# EAGLE schematic TellitShieldV45JR (EAGLE 5.11)
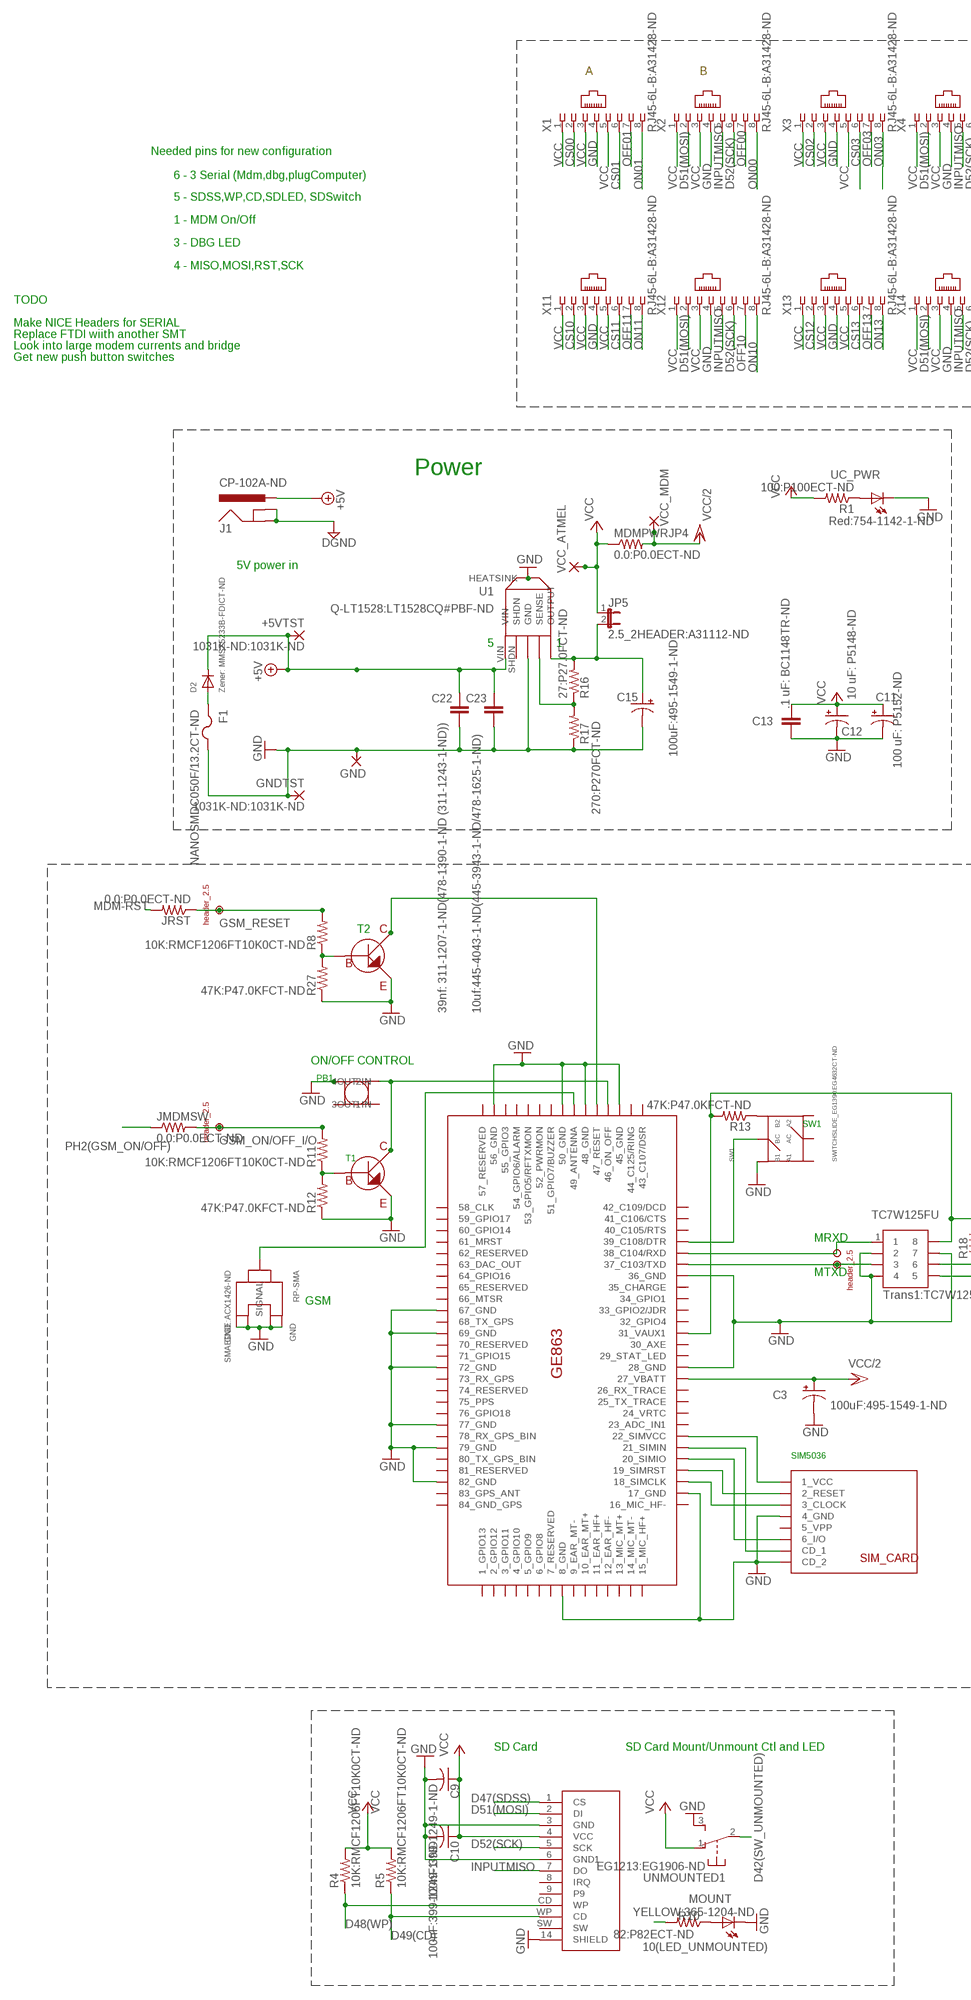
[diagram p0: schematic, sheet 1, part 1 of 2]
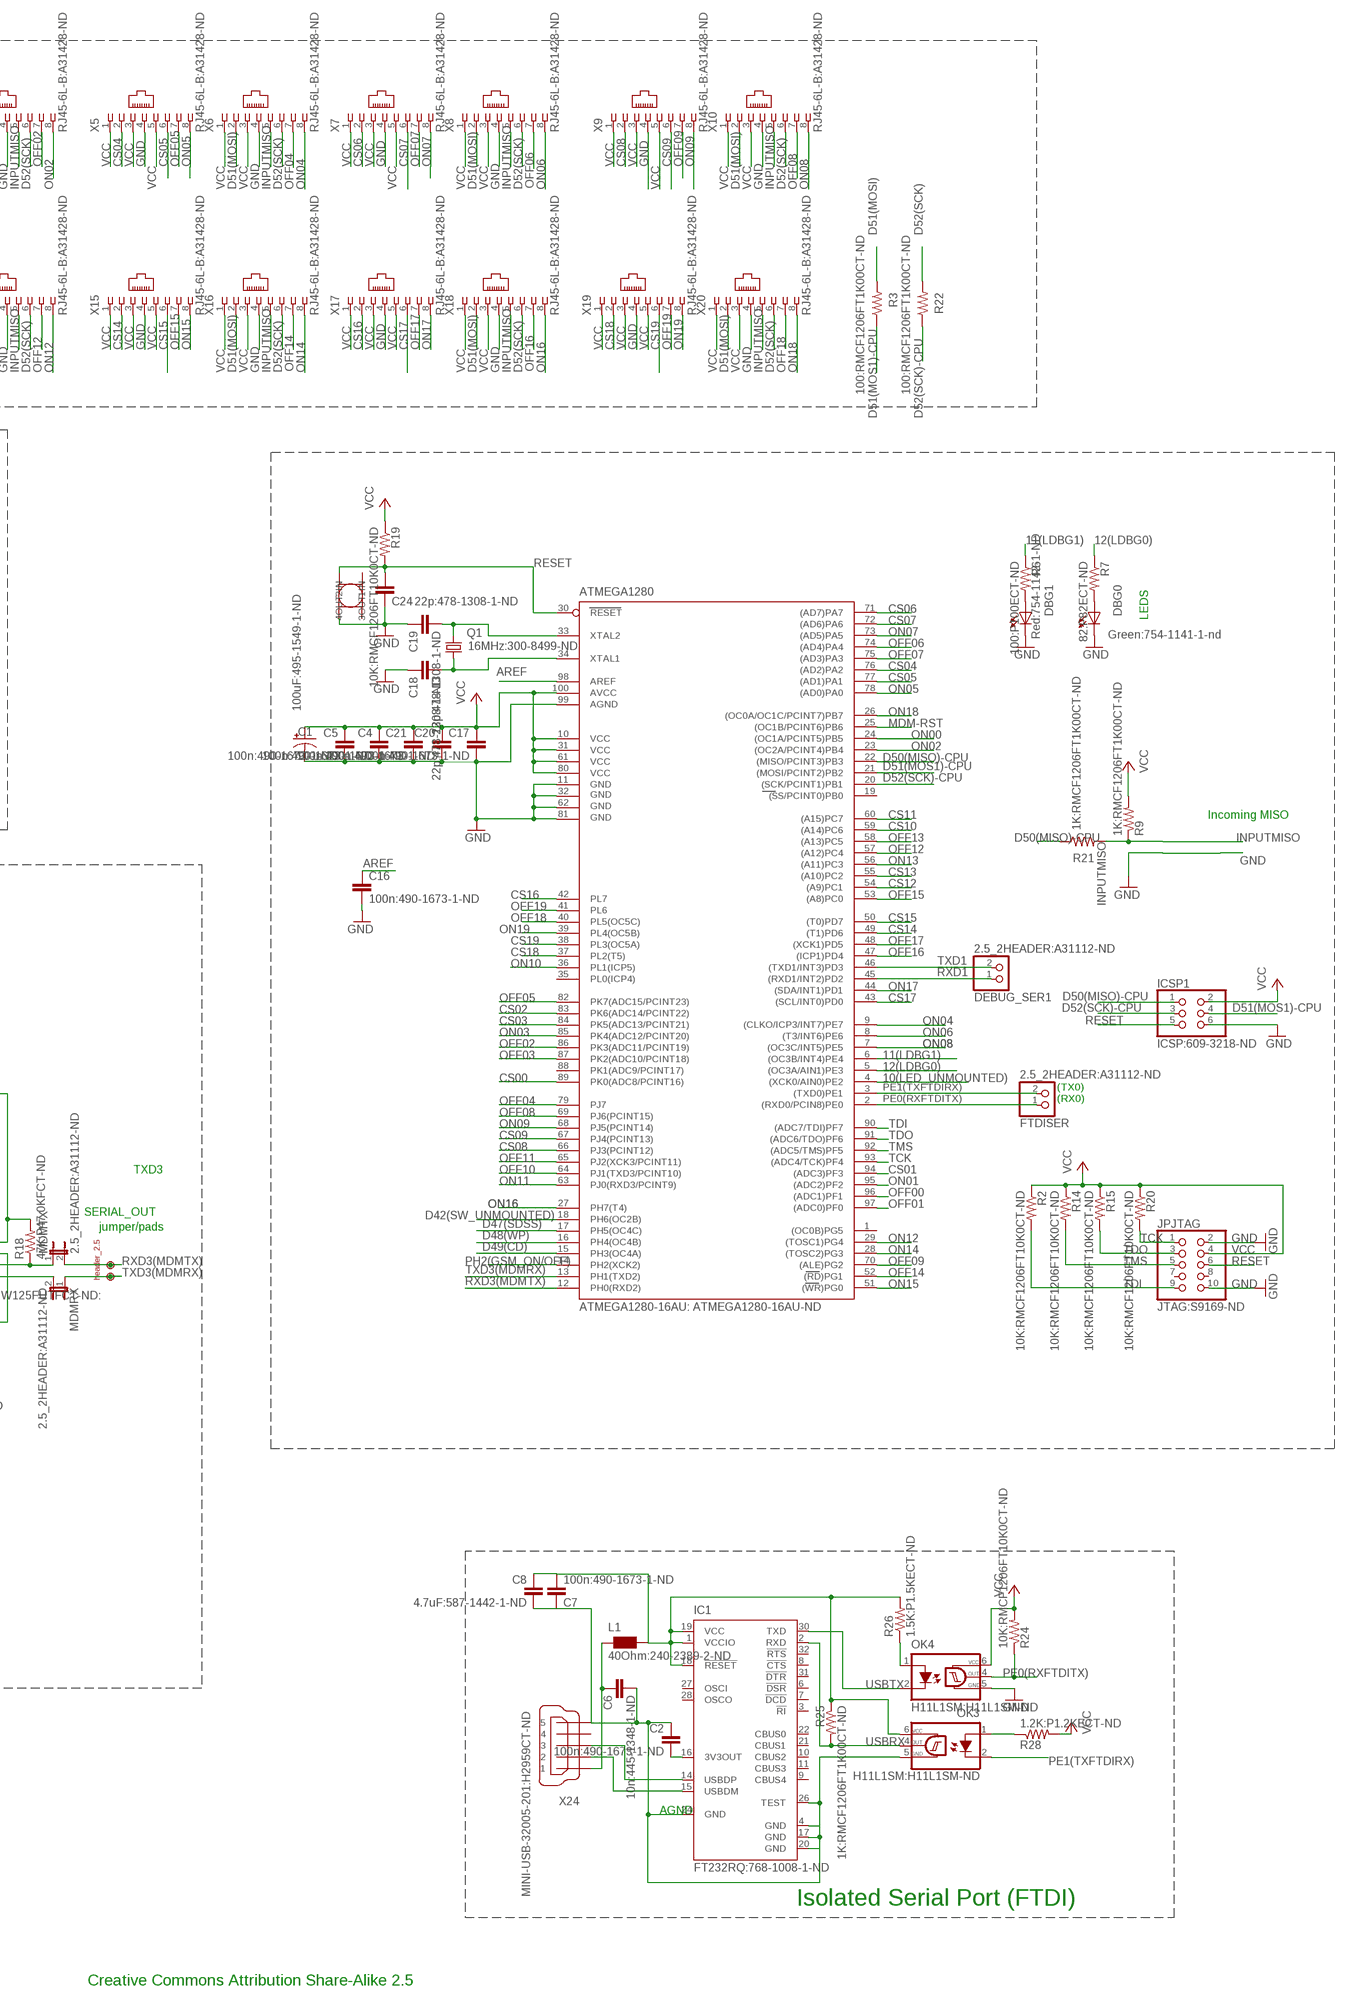
[diagram p1: schematic, sheet 1, part 2 of 2]

## Parts
+5VTST  1031K-ND:1031K-ND  2,54/0,9  [2,54/0,9]
ATMEGA1280  ATMEGA1280-16AU: ATMEGA1280-16AU-ND  ATMEGA1280-16AU  [TQFP100]
C1  100uF:495-1549-1-ND  CPOL-USD/7343-31R  [D/7343-31R]
C2  100n:490-1673-1-ND  C-EUC0805  [C0805]
C3  100uF:495-1549-1-ND  CPOL-USD/7343-31R  [D/7343-31R]
C4  100n:490-1673-1-ND  C-EUC0805  [C0805]
C5  100n:490-1673-1-ND  C-EUC0805  [C0805]
C6  10n:445-1348-1-ND  C-EUC0805  [C0805]
C7  100n:490-1673-1-ND  C-EUC0805  [C0805]
C8  4.7uF:587-1442-1-ND  C-EUC0805  [C0805]
C9  100nF:399-1249-1-ND  C-USC1206  [C1206]
C10  100nF:399-1249-1-ND  C-USC1206  [C1206]
C11  100 uF: P5152-ND  CAP_POLPTH1  [CPOL-RADIAL-100UF-25V]
C12  10 uF: P5148-ND  CAP_POLPTH2  [CPOL-RADIAL-10UF-25V]
C13  .1 uF: BC1148TR-ND  CAPPTH  [CAP-PTH-SMALL]
C15  100uF:495-1549-1-ND  CPOL-USD/7343-31R  [D/7343-31R]
C16  100n:490-1673-1-ND  C-EUC0805  [C0805]
C17  100n:490-1673-1-ND  C-EUC0805  [C0805]
C18  22p:478-1308-1-ND  C-EUC0805  [C0805]
C19  22p:478-1308-1-ND  C-EUC0805  [C0805]
C20  100n:490-1673-1-ND  C-EUC0805  [C0805]
C21  100n:490-1673-1-ND  C-EUC0805  [C0805]
C22  39nf: 311-1207-1-ND(478-1390-1-ND (311-1243-1-ND))  C-EUC1206  [C1206]
C23  10uf:445-4043-1-ND(445-3943-1-ND/478-1625-1-ND)  C-EUC1206  [C1206]
C24  22p:478-1308-1-ND  C-EUC0805  [C0805]
D2  Zener: MMSZ5233B-FDICT-ND  DIODESOD-123  [SOD-123]
DBG0  Green:754-1141-1-nd  LEDCHIPLED_1206  [CHIPLED_1206]
DBG1  Red:754-1142-1-ND  LEDCHIPLED_1206  [CHIPLED_1206]
DEBUG_SER1  2.5_2HEADER:A31112-ND  PINHD-1X2  [1X02]
F1  NANOSMDC050F/13.2CT-ND  PTCFUSE-1206  [R1206]
FTDISER  2.5_2HEADER:A31112-ND  PINHD-1X2  [1X02]
GE863  GE836  [GE836]
GND  3,81/1,4  [3,81/1,4]
GNDTST  1031K-ND:1031K-ND  2,54/0,9  [2,54/0,9]
IC1  FT232RQ:768-1008-1-ND  FT232RQ  [QFN32]
ICSP1  ICSP:609-3218-ND  PINHD-2X3  [2X03]
J1  CP-102A-ND  POWER_JACKPTH  [POWER_JACK_PTH]
JMDMSW  0.0:P0.0ECT-ND  R-US_R1206  [R1206]
JP5  2.5_2HEADER:A31112-ND  JUMPER-2PTH  [1X02]
JPJTAG  JTAG:S9169-ND  PINHD-2X5  [2X05]
JRST  0.0:P0.0ECT-ND  R-US_R1206  [R1206]
L1  40Ohm:240-2389-2-ND  WE-CBF_0805  [0805]
MDMPWRJP4  0.0:P0.0ECT-ND  R-US_R1206  [R1206]
MDMRX  2.5_2HEADER:A31112-ND  JUMPER-2PTH  [1X02]
MDMTX  2.5_2HEADER:A31112-ND  JUMPER-2PTH  [1X02]
MOUNT  YELLOW:365-1204-ND  LED5MM  [LED5MM]
OK3  H11L1SM:H11L1SM-ND  H11L1MS  [DIL6-SMD]
OK4  H11L1SM:H11L1SM-ND  H11L1MS  [DIL6-SMD]
POWER1  uSW:CKN9104CT-ND  SWITCHPB_KPT-1187B  [SWITCHPB_KPT-1187B]
Q1  16MHz:300-8499-ND  CRYTALHC49S  [HC49/S]
R1  100:P100ECT-ND  R-US_R1206  [R1206]
R2  10K:RMCF1206FT10K0CT-ND  R-US_R1206  [R1206]
R3  100:RMCF1206FT1K00CT-ND  R-US_R1206  [R1206]
R4  10K:RMCF1206FT10K0CT-ND  R-US_R1206  [R1206]
R5  10K:RMCF1206FT10K0CT-ND  R-US_R1206  [R1206]
R6  100:P100ECT-ND  R-US_R1206  [R1206]
R7  82:P82ECT-ND  R-US_R1206  [R1206]
R8  10K:RMCF1206FT10K0CT-ND  R-US_R1206  [R1206]
R9  1K:RMCF1206FT1K00CT-ND  R-US_R1206  [R1206]
R10  82:P82ECT-ND  R-US_R1206  [R1206]
R11  10K:RMCF1206FT10K0CT-ND  R-US_R1206  [R1206]
R12  47K:P47.0KFCT-ND  R-US_R1206  [R1206]
R13  47K:P47.0KFCT-ND  R-US_R1206  [R1206]
R14  10K:RMCF1206FT10K0CT-ND  R-US_R1206  [R1206]
R15  10K:RMCF1206FT10K0CT-ND  R-US_R1206  [R1206]
R16  27:P27.0FCT-ND  R-US_R1206  [R1206]
R17  270:P270FCT-ND  R-US_R1206  [R1206]
R18  47K:P47.0KFCT-ND  R-US_R1206  [R1206]
R19  10K:RMCF1206FT10K0CT-ND  R-US_R1206  [R1206]
R20  10K:RMCF1206FT10K0CT-ND  R-US_R1206  [R1206]
R21  1K:RMCF1206FT1K00CT-ND  R-US_R1206  [R1206]
R22  100:RMCF1206FT1K00CT-ND  R-US_R1206  [R1206]
R24  10K:RMCF1206FT10K0CT-ND  R-US_R1206  [R1206]
R25  1K:RMCF1206FT1K00CT-ND  R-US_R1206  [R1206]
R26  1.5K:P1.5KECT-ND  R-US_R1206  [R1206]
R27  47K:P47.0KFCT-ND  R-US_R1206  [R1206]
R28  1.2K:P1.2KECT-ND  R-US_R1206  [R1206]
RESET  uSW:CKN9104CT-ND  SWITCHPB_KPT-1187B  [SWITCHPB_KPT-1187B]
RP-SMA  SMAEDGE:ACX1426-ND  RP-SMA_BOARD_EDGE142-0711-821  [RP-SMA_SMALL]
RX/TX_ATMEL  2.5_2HEADER:DNS  2.5_2HEADER  [2.5_2HEADER]
RX/TX_TELIT  2.5_2HEADER:DNS  2.5_2HEADER  [2.5_2HEADER]
SD-CARD  SD_CARD_SOCKETEASY_SOLDER  [SD-MMC_SOCKET-PP_SHORT_BUS]
SIM5036  SIMCARD_5036:478-5061-1-ND  SIMCARD_5036  [SIMCARD_5036]
SW1  SWITCHSLIDE_EG1390:EG4632CT-ND  SWITCHSLIDE_EG1390  [SWITCHSLIDE_EG1390]
T1  T1:MMBT2222A-FDICT-ND  SOT-23_MMBT4403  [SOT-23_MMBT4403]
T2  T1:MMBT2222A-FDICT-ND  SOT-23_MMBT4403  [SOT-23_MMBT4403]
TC7W125FU  Trans1:TC7W125FUTFCT-ND:  SSOP8  [SSOP8]
TELIT_ON/OFF  2.5_1HEADER:DNS  2.5_1HEADER  [2.5_1HEADER]
TELIT_ON/OFF1  2.5_1HEADER  [2.5_1HEADER]
U1  Q-LT1528:LT1528CQ#PBF-ND  Q-LT1528  [Q-LT1528]
UC_PWR  Red:754-1142-1-ND  LEDCHIPLED_1206  [CHIPLED_1206]
UNMOUNTED  EG1213:EG1906-ND  EG1213  [EG1213]
VCC_ATMEL  3,81/1,4  [3,81/1,4]
VCC_MDM  3,81/1,4  [3,81/1,4]
X1  RJ45-6L-B:A31428-ND  RJ45RJ45-NO-SHIELD_VERTJR  [RJ45-NO-SHIELD_VERT]
X2  RJ45-6L-B:A31428-ND  RJ45RJ45-NO-SHIELD_VERTJR  [RJ45-NO-SHIELD_VERT]
X3  RJ45-6L-B:A31428-ND  RJ45RJ45-NO-SHIELD_VERTJR  [RJ45-NO-SHIELD_VERT]
X4  RJ45-6L-B:A31428-ND  RJ45RJ45-NO-SHIELD_VERTJR  [RJ45-NO-SHIELD_VERT]
X5  RJ45-6L-B:A31428-ND  RJ45RJ45-NO-SHIELD_VERTJR  [RJ45-NO-SHIELD_VERT]
X6  RJ45-6L-B:A31428-ND  RJ45RJ45-NO-SHIELD_VERTJR  [RJ45-NO-SHIELD_VERT]
X7  RJ45-6L-B:A31428-ND  RJ45RJ45-NO-SHIELD_VERTJR  [RJ45-NO-SHIELD_VERT]
X8  RJ45-6L-B:A31428-ND  RJ45RJ45-NO-SHIELD_VERTJR  [RJ45-NO-SHIELD_VERT]
X9  RJ45-6L-B:A31428-ND  RJ45RJ45-NO-SHIELD_VERTJR  [RJ45-NO-SHIELD_VERT]
X10  RJ45-6L-B:A31428-ND  RJ45RJ45-NO-SHIELD_VERTJR  [RJ45-NO-SHIELD_VERT]
X11  RJ45-6L-B:A31428-ND  RJ45RJ45-NO-SHIELD_VERTJR  [RJ45-NO-SHIELD_VERT]
X12  RJ45-6L-B:A31428-ND  RJ45RJ45-NO-SHIELD_VERTJR  [RJ45-NO-SHIELD_VERT]
X13  RJ45-6L-B:A31428-ND  RJ45RJ45-NO-SHIELD_VERTJR  [RJ45-NO-SHIELD_VERT]
X14  RJ45-6L-B:A31428-ND  RJ45RJ45-NO-SHIELD_VERTJR  [RJ45-NO-SHIELD_VERT]
X15  RJ45-6L-B:A31428-ND  RJ45RJ45-NO-SHIELD_VERTJR  [RJ45-NO-SHIELD_VERT]
X16  RJ45-6L-B:A31428-ND  RJ45RJ45-NO-SHIELD_VERTJR  [RJ45-NO-SHIELD_VERT]
X17  RJ45-6L-B:A31428-ND  RJ45RJ45-NO-SHIELD_VERTJR  [RJ45-NO-SHIELD_VERT]
X18  RJ45-6L-B:A31428-ND  RJ45RJ45-NO-SHIELD_VERTJR  [RJ45-NO-SHIELD_VERT]
X19  RJ45-6L-B:A31428-ND  RJ45RJ45-NO-SHIELD_VERTJR  [RJ45-NO-SHIELD_VERT]
X20  RJ45-6L-B:A31428-ND  RJ45RJ45-NO-SHIELD_VERTJR  [RJ45-NO-SHIELD_VERT]
X24  MINI-USB-32005-201:H2959CT-ND  MINI-USB-32005-201  [32005-201]

## Nets
10(LED_UNMOUNTED): ATMEGA1280.4((XCK0/AIN0)PE2) R10.2
11(LDBG1): ATMEGA1280.6((OC3B/INT4)PE4) R6.1
12(LDBG0): ATMEGA1280.5((OC3A/AIN1)PE3) R7.1
31_VAUX: GE863.31_VAUX1 R13.2 R18.2 TC7W125FU.8
+5V [power]: +5VTST.1(P) C22.1 C23.1 D2.C J1.PWR U1.VIN
AREF: ATMEGA1280.98(AREF) C16.1
CS00: ATMEGA1280.89(PK0(ADC8/PCINT16)) X1.2
CS01: ATMEGA1280.94((ADC3)PF3) X1.6
CS02: ATMEGA1280.83(PK6(ADC14/PCINT22)) X3.2
CS03: ATMEGA1280.84(PK5(ADC13/PCINT21)) X3.6
CS04: ATMEGA1280.76((AD2)PA2) X5.2
CS05: ATMEGA1280.77((AD1)PA1) X5.6
CS06: ATMEGA1280.71((AD7)PA7) X7.2
CS07: ATMEGA1280.72((AD6)PA6) X7.6
CS08: ATMEGA1280.66(PJ3(PCINT12)) X9.2
CS09: ATMEGA1280.67(PJ4(PCINT13)) X9.6
CS10: ATMEGA1280.59((A14)PC6) X11.2
CS11: ATMEGA1280.60((A15)PC7) X11.6
CS12: ATMEGA1280.54((A9)PC1) X13.2
CS13: ATMEGA1280.55((A10)PC2) X13.6
CS14: ATMEGA1280.49((T1)PD6) X15.2
CS15: ATMEGA1280.50((T0)PD7) X15.6
CS16: ATMEGA1280.42(PL7) X17.2
CS17: ATMEGA1280.43((SCL/INT0)PD0) X17.6
CS18: ATMEGA1280.37(PL2(T5)) X19.2
CS19: ATMEGA1280.38(PL3(OC5A)) X19.6
D42(SW_UNMOUNTED): ATMEGA1280.18(PH6(OC2B)) UNMOUNTED.2(1:P)
D47(SDSS): ATMEGA1280.17(PH5(OC4C)) SD-CARD.1(CS)
D48(WP): ATMEGA1280.16(PH4(OC4B)) R4.1 SD-CARD.CD(WP)
D49(CD): ATMEGA1280.15(PH3(OC4A)) R5.1 SD-CARD.WP(CD)
D50(MISO)-CPU: ATMEGA1280.22((MISO/PCINT3)PB3) ICSP1.1 R21.1
D51(MOS1)-CPU: ATMEGA1280.21((MOSI/PCINT2)PB2) ICSP1.4 R3.1
D51(MOSI): R3.2 SD-CARD.2(DI) X2.2 X4.2 X6.2 X8.2 X10.2 X12.2 X14.2 X16.2 X18.2 X20.2
D52(SCK): R22.2 SD-CARD.5(SCK) X2.6 X4.6 X6.6 X8.6 X10.6 X12.6 X14.6 X16.6 X18.6 X20.6
D52(SCK)-CPU: ATMEGA1280.20((SCK/PCINT1)PB1) ICSP1.3 R22.1
DTR: GE863.39_C108/DTR SW1.BCOM
GND [gnd]: ATMEGA1280.11(GND) ATMEGA1280.32(GND1) ATMEGA1280.62(GND2) ATMEGA1280.81(GND3) ATMEGA1280.99(AGND) C1.- C3.- C4.2 C5.2 C9.2 C10.2 C11.2(-) C12.2(-) C13.2 C15.- C16.2 C17.2 C18.1 C19.1 C20.2 C21.2 C22.2 C23.2 C24.1 DBG0.C DBG1.C F1.2 GE863.8_GND GE863.17_GND GE863.28_GND GE863.36_GND GE863.45_GND GE863.48_GND GE863.50_GND GE863.56_GND GE863.67_GND GE863.69_GND GE863.72_GND GE863.77_GND GE863.79_GND GE863.82_GND GND.1(P) GNDTST.1(P) ICSP1.6 J1.GND J1.GNDBREAK JPJTAG.2 JPJTAG.10 MOUNT.K(C) OK4.5(GND) POWER1.2IN R12.1 R17.1 R27.1 RESET.2IN RP-SMA.P$1(1GND) RP-SMA.P$2(2GND) RP-SMA.P$3(3GND) RP-SMA.P$4(4GND) SD-CARD.3(GND) SD-CARD.6(GND1) SD-CARD.14(SHIELD) SIM5036.4_GND SIM5036.CD_2 SW1.B1 T1.E T2.E TC7W125FU.2 TC7W125FU.4 TC7W125FU.7 U1.GND U1.HEATSINK UC_PWR.C UNMOUNTED.3(1:S) X1.4 X2.4 X3.4 X4.4 X5.4 X6.4 X7.4 X8.4 X9.4 X10.4 X11.4 X12.4 X13.4 X14.4 X15.4 X16.4 X17.4 X18.4 X19.4 X20.4 ; supply symbol labelled DGND
GSM_ON/OFF_I/O: JMDMSW.2 R11.2 TELIT_ON/OFF.P$1(H1)
GSM_RESET: JRST.1 R8.2 TELIT_ON/OFF1.P$1(H1)
INPUTMISO: R9.1 R21.2 SD-CARD.7(DO) X2.5 X4.5 X6.5 X8.5 X10.5 X12.5 X14.5 X16.5 X18.5 X20.5
MDM-RST: ATMEGA1280.25((OC1B/PCINT6)PB6) JRST.2
N$2: OK3.1(A) R28.1
N$5: R13.1 SW1.B2
N$7: DBG1.A R6.2
N$8: DBG0.A R7.2
N$9: D2.A F1.1
N$10: R8.1 R27.2 T2.B
N$11: MOUNT.A R10.1
N$12: GE863.47_RESET T2.C
N$13: MDMTX.1 R18.1 TC7W125FU.6
N$14 [VCC]: OK4.1(A) R26.1
N$15: GE863.46_ON_OFF POWER1.4OUT T1.C
N$16 [aSignal]: GE863.49_ANTENNA RP-SMA.SIGNAL
N$53: R11.1 R12.2 T1.B
N$126: R1.1 UC_PWR.A
NS3V3OUT: C2.2 IC1.16(3V3OUT)
OFF00: ATMEGA1280.96((ADC1)PF1) X2.7
OFF01: ATMEGA1280.97((ADC0)PF0) X1.7
OFF02: ATMEGA1280.86(PK3(ADC11/PCINT19)) X4.7
OFF03: ATMEGA1280.87(PK2(ADC10/PCINT18)) X3.7
OFF04: ATMEGA1280.79(PJ7) X6.7
OFF05: ATMEGA1280.82(PK7(ADC15/PCINT23)) X5.7
OFF06: ATMEGA1280.74((AD4)PA4) X8.7
OFF07: ATMEGA1280.75((AD3)PA3) X7.7
OFF08: ATMEGA1280.69(PJ6(PCINT15)) X10.7
OFF09: ATMEGA1280.70((ALE)PG2) X9.7
OFF10: ATMEGA1280.64(PJ1(TXD3/PCINT10)) X12.7
OFF11 [VCC]: ATMEGA1280.65(PJ2(XCK3/PCINT11)) X11.7
OFF12: ATMEGA1280.57((A12)PC4) X14.7
OFF13: ATMEGA1280.58((A13)PC5) X13.7
OFF14: ATMEGA1280.52((RD)PG1) X16.7
OFF15: ATMEGA1280.53((A8)PC0) X15.7
OFF16: ATMEGA1280.47((ICP1)PD4) X18.7
OFF17: ATMEGA1280.48((XCK1)PD5) X17.7
OFF18: ATMEGA1280.40(PL5(OC5C)) X20.7
OFF19: ATMEGA1280.41(PL6) X19.7
ON00 [gnd]: ATMEGA1280.24((OC1A/PCINT5)PB5) X2.8
ON01 [gnd]: ATMEGA1280.95((ADC2)PF2) X1.8
ON02 [gnd]: ATMEGA1280.23((OC2A/PCINT4)PB4) X4.8
ON03 [gnd]: ATMEGA1280.85(PK4(ADC12/PCINT20)) X3.8
ON04 [gnd]: ATMEGA1280.9((CLKO/ICP3/INT7)PE7) X6.8
ON05 [gnd]: ATMEGA1280.78((AD0)PA0) X5.8
ON06 [gnd]: ATMEGA1280.8((T3/INT6)PE6) X8.8
ON07 [gnd]: ATMEGA1280.73((AD5)PA5) X7.8
ON08 [gnd]: ATMEGA1280.7((OC3C/INT5)PE5) X10.8
ON09 [gnd]: ATMEGA1280.68(PJ5(PCINT14)) X9.8
ON10 [gnd]: ATMEGA1280.36(PL1(ICP5)) X12.8
ON11 [gnd]: ATMEGA1280.63(PJ0(RXD3/PCINT9)) X11.8
ON12 [gnd]: ATMEGA1280.29((TOSC1)PG4) X14.8
ON13 [gnd]: ATMEGA1280.56((A11)PC3) X13.8
ON14 [gnd]: ATMEGA1280.28((TOSC2)PG3) X16.8
ON15 [gnd]: ATMEGA1280.51((WR)PG0) X15.8
ON16 [gnd]: ATMEGA1280.27(PH7(T4)) X18.8
ON17 [gnd]: ATMEGA1280.44((SDA/INT1)PD1) X17.8
ON18 [gnd]: ATMEGA1280.26((OC0A/OC1C/PCINT7)PB7) X20.8
ON19 [gnd]: ATMEGA1280.39(PL4(OC5B)) X19.8
OUTPUT [VCC]: C15.+ JP5.2 R16.2 U1.OUTPUT
PE0(RXFTDITX): ATMEGA1280.2((RXD0/PCIN8)PE0) FTDISER.1 OK4.4(OUT) R24.1
PE1(TXFTDIRX): ATMEGA1280.3((TXD0)PE1) FTDISER.2 OK3.2(C)
PH2(GSM_ON/OFF): ATMEGA1280.14(PH2(XCK2)) JMDMSW.1
RESET: ATMEGA1280.30(RESET) C24.2 ICSP1.5 JPJTAG.6 R19.2 RESET.4OUT
RXD: GE863.38_C104/RXD RX/TX_TELIT.P$1(H1) TC7W125FU.1
RXD1: ATMEGA1280.45((RXD1/INT2)PD2) DEBUG_SER1.1
RXD3(MDMTX): ATMEGA1280.12(PH0(RXD2)) MDMTX.2 RX/TX_ATMEL.P$2(H2)
SENCE: R16.1 R17.2 U1.SENCE(SENSE)
SIMCLOCK: GE863.18_SIMCLK SIM5036.3_CLOCK
SIMIN: GE863.21_SIMIN SIM5036.CD_1
SIMIO: GE863.20_SIMIO SIM5036.6_I/O
SIMRESET: GE863.19_SIMRST SIM5036.2_RESET
SIMVCC: GE863.22_SIMVCC SIM5036.1_VCC
TCK: ATMEGA1280.93((ADC4/TCK)PF4) JPJTAG.1 R20.2
TDI: ATMEGA1280.90((ADC7/TDI)PF7) JPJTAG.9 R2.2
TDO: ATMEGA1280.91((ADC6/TDO)PF6) JPJTAG.3 R15.2
TMS: ATMEGA1280.92((ADC5/TMS)PF5) JPJTAG.5 R14.2
TXD: GE863.37_C103/TXD RX/TX_TELIT.P$2(H2) TC7W125FU.3
TXD1: ATMEGA1280.46((TXD1/INT3)PD3) DEBUG_SER1.2
TXD3(MDMRX): ATMEGA1280.13(PH1(TXD2)) MDMRX.1 RX/TX_ATMEL.P$1(H1)
TXD_IN: MDMRX.2 TC7W125FU.5
USB5VP1 [VCC]: C6.1 L1.1 X24.1
USB+5V [VCC]: C7.2 C8.1 IC1.1(VCCIO) IC1.18(!RESET) IC1.19(VCC) L1.2 OK3.6(VCC) R25.1 R26.2
USBDM: IC1.15(USBDM) X24.2
USBDP: IC1.14(USBDP) X24.3
USBGND [gnd]: C2.1 C6.2 C7.1 C8.2 IC1.4(GND) IC1.17(GND) IC1.20(GND) IC1.24(GND) IC1.26(TEST) OK3.5(GND) X24.5
USBRX: IC1.2(RXD) OK3.4(OUT) R25.2
USBTX: IC1.30(TXD) OK4.2(C)
VCC [VCC]: ATMEGA1280.10(VCC) ATMEGA1280.31(VCC1) ATMEGA1280.61(VCC2) ATMEGA1280.80(VCC3) ATMEGA1280.100(AVCC) C1.+ C4.1 C5.1 C9.1 C10.1 C11.1(+) C12.1(+) C13.1 C17.1 C20.1 C21.1 ICSP1.2 JP5.1 JPJTAG.4 MDMPWRJP4.1 OK4.6(VCC) R1.2 R2.1 R4.2 R5.2 R9.2 R14.1 R15.1 R19.1 R20.1 R24.2 R28.2 SD-CARD.4(VCC) UNMOUNTED.1(1:O) VCC_ATMEL.1(P) X1.1 X1.3 X1.5 X2.1 X2.3 X3.1 X3.3 X3.5 X4.1 X4.3 X5.1 X5.3 X5.5 X6.1 X6.3 X7.1 X7.3 X7.5 X8.1 X8.3 X9.1 X9.3 X9.5 X10.1 X10.3 X11.1 X11.3 X11.5 X12.1 X12.3 X13.1 X13.3 X13.5 X14.1 X14.3 X15.1 X15.3 X15.5 X16.1 X16.3 X17.1 X17.3 X17.5 X18.1 X18.3 X19.1 X19.3 X19.5 X20.1 X20.3
VCC/2: C3.+ GE863.27_VBATT MDMPWRJP4.2 VCC_MDM.1(P)
XTAL1: ATMEGA1280.34(XTAL1) C18.2 Q1.1
XTAL2: ATMEGA1280.33(XTAL2) C19.2 Q1.2
Unconnected: ATMEGA1280.1((OC0B)PG5) ATMEGA1280.19((SS/PCINT0)PB0) ATMEGA1280.35(PL0(ICP4)) ATMEGA1280.88(PK1(ADC9/PCINT17)) GE863.1_GPIO13 GE863.2_GPIO12 GE863.3_GPIO11 GE863.4_GPIO10 GE863.5_GPIO9 GE863.6_GPIO8 GE863.7_RESERVED GE863.9_EAR_MT- GE863.10_EAR_MT+ GE863.11_EAR_HF+ GE863.12_EAR_HF- GE863.13_MIC_MT+ GE863.14_MIC_MT- GE863.15_MIC_HF+ GE863.16_MIC_HF- GE863.23_ADC_IN1 GE863.24_VRTC GE863.25_TX_TRACE GE863.26_RX_TRACE GE863.29_STAT_LED GE863.30_AXE GE863.32_GPIO4 GE863.33_GPIO2/JDR GE863.34_GPIO1 GE863.35_CHARGE GE863.40_C105/RTS GE863.41_C106/CTS GE863.42_C109/DCD GE863.43_C107/DSR GE863.44_C125/RING GE863.51_GPIO7/BUZZER GE863.52_PWRMON GE863.53_GPIO5/RFTXMON GE863.54_GPIO6/ALARM GE863.55_GPIO3 GE863.57_RESERVED GE863.58_CLK GE863.59_GPIO17 GE863.60_GPIO14 GE863.61_MRST GE863.62_RESERVED GE863.63_DAC_OUT GE863.64_GPIO16 GE863.65_RESERVED GE863.66_MTSR GE863.68_TX_GPS GE863.70_RESERVED GE863.71_GPIO15 GE863.73_RX_GPS GE863.74_RESERVED GE863.75_PPS GE863.76_GPIO18 GE863.78_RX_GPS_BIN GE863.80_TX_GPS_BIN GE863.81_RESERVED GE863.83_GPS_ANT GE863.84_GND_GPS IC1.3(!RI) IC1.6(!DSR) IC1.7(!DCD) IC1.8(!CTS) IC1.9(CBUS4) IC1.10(CBUS2) IC1.11(CBUS3) IC1.21(CBUS1) IC1.22(CBUS0) IC1.27(OSCI) IC1.28(OSCO) IC1.31(!DTR) IC1.32(!RTS) JPJTAG.7 JPJTAG.8 POWER1.1IN POWER1.3OUT RESET.1IN RESET.3OUT SD-CARD.8(IRQ) SD-CARD.9 SD-CARD.SW SIM5036.5_VPP SW1.A1 SW1.A2 SW1.ACOM U1.SHDN UNMOUNTED.MT1(MT) UNMOUNTED.MT2(MT) X24.4

## Notes on the sheet
- A | B
- Needed pins for new configuration
- 6 - 3 Serial (Mdm,dbg,plugComputer)
- 5 - SDSS,WP,CD,SDLED, SDSwitch
- 1 - MDM On/Off
- 3 - DBG LED
- 4 - MISO,MOSI,RST,SCK
- TODO
- Make NICE Headers for SERIAL
- Replace FTDI wiith another SMT
- Look into large modem currents and bridge
- Get new push button switches
- Power
- 5V power in
- LEDS
- 5 | 1
- Incoming MISO
- T2
- ON/OFF CONTROL
- PB1
- (TX0)
- (RX0)
- SW1
- T1
- TXD3
- SERIAL_OUT
- jumper/pads
- MRXD
- MTXD
- GSM
- SIM5036
- SD Card | SD Card Mount/Unmount Ctl and LED
- AGND
- Isolated Serial Port (FTDI)
- Creative Commons Attribution Share-Alike 2.5

## Library data of the parts
+5VTST GNDTST = wirepad:2,54/0,9: THROUGH-HOLE PAD
ATMEGA1280 = atmel-2005:ATMEGA*: MICROCONTROLLER 64/128/256 Kbytes FLASH 4 Kbytes EEPROM 8 Kbytes SRAM 86 General Purpose I/O pins 12-channels16-bit PWM 4 x Serial USARTs 16-channels 10-bit A/D
C1 C3 C15 = rcl:CPOL-US: POLARIZED CAPACITOR, American symbol
C2 C4-C8 C16-C24 = rcl:C-EU: CAPACITOR, European symbol
C9 C10 = adafruit:C-US: CAPACITOR, American symbol
C11 C12 = SparkFun:CAP_POL: Capacitor Polarized These are standard SMD and PTH capacitors. Normally 10uF, 47uF, and 100uF in electrolytic and tantalum varieties. Always verify the external diameter of the through hole cap, it varies with capacity, voltage, and manufacturer. The EIA devices should be standard.
C13 = SparkFun:CAP: Capacitor Standard 0603 ceramic capacitor, and 0.1" leaded capacitor.
D2 = adafruit:DIODE: Diode SMADIODE - SMA Surface Mount Package 20V 1A Schottky Diode Digikey: 641-1014-6-ND DO-1N4148 - Through Hole Small Current Diode SOD-123 20V 1 A (.5mV Vf) Schottky Diode - Digikey: MBRX120TPMSCT-ND SOD-323 10V 570mA (.38mV Vf, 3ns) Schottky Diode - Digikey: ZLLS410CT-ND SOD-523 30V 30mA Schottky Diode (RB751S-40TE61) - Digikey: RB751S-40TE61CT-ND SOT23-R/W - SOT23 Package (R = Solder Paste/Reflow Ovens, W = Hand-Soldering) BAT54Film 40V 300mA - Digikey: 497-7162-1-ND
DBG0 DBG1 MOUNT UC_PWR = led:LED: LED OSRAM: - CHIPLED LG R971, LG N971, LY N971, LG Q971, LY Q971, LO R971, LY R971 LH N974, LH R974 LS Q976, LO Q976, LY Q976 LO Q996 - Hyper CHIPLED LW Q18S LB Q993, LB Q99A, LB R99A - SideLED LS A670, LO A670, LY A670, LG A670, LP A670 LB A673, LV A673, LT A673, LW A673 LH A674 LY A675 LS A676, LA A676, LO A676, LY A676, LW A676 LS A679, LY A679, LG A679 - Hyper Micro SIDELED® LS Y876, LA Y876, LO Y876, LY Y876 LT Y87S - SmartLED LW L88C, LW L88S LB L89C, LB L89S, LG L890 LS L89K, LO L89K, LY L89K LS L896, LA L896, LO L896, LY L896 - TOPLED LS T670, LO T670, LY T670, LG T670, LP T670 LSG T670, LSP T670, LSY T670, LOP T670, LYG T670 LG T671, LOG T671, LSG T671 LB T673, LV T673, LT T673, LW T673 LH T674 LS T676, LA T676, LO T676, LY T676, LB T676, LH T676, LSB T676, LW T676 LB T67C, LV T67C, LT T67C, LS T67K, LO T67K, LY T67K, LW E67C LS E67B, LA E67B, LO E67B, LY E67B, LB E67C, LV E67C, LT E67C LW T67C LS T679, LY T679, LG T679 LS T770, LO T770, LY T770, LG T770, LP T770 LB T773, LV T773, LT T773, LW T773 LH T774 LS E675, LA E675, LY E675, LS T675 LS T776, LA T776, LO T776, LY T776, LB T776 LHGB T686 LT T68C, LB T68C - Hyper Mini TOPLED® LB M676 - Mini TOPLED Santana® LG M470 LS M47K, LO M47K, LY M47K Source: http://www.osram.convergy.de LUXEON: - LUMILED® LXK2-PW12-R00, LXK2-PW12-S00, LXK2-PW14-U00, LXK2-PW14-V00 LXK2-PM12-R00, LXK2-PM12-S00, LXK2-PM14-U00 LXK2-PE12-Q00, LXK2-PE12-R00, LXK2-PE12-S00, LXK2-PE14-T00, LXK2-PE14-U00 LXK2-PB12-K00, LXK2-PB12-L00, LXK2-PB12-M00, LXK2-PB14-N00, LXK2-PB14-P00, LXK2-PB14-Q00 LXK2-PR12-L00, LXK2-PR12-M00, LXK2-PR14-Q00, LXK2-PR14-R00 LXK2-PD12-Q00, LXK2-PD12-R00, LXK2-PD12-S00 LXK2-PH12-R00, LXK2-PH12-S00 LXK2-PL12-P00, LXK2-PL12-Q00, LXK2-PL12-R00 Source: www.luxeon.com KINGBRIGHT: KA-3528ASYC Source: www.kingbright.com
DEBUG_SER1 FTDISER = pinhead:PINHD-1X2: PIN HEADER
F1 = adafruit:PTCFUSE: PTC fuses, resettable thermistors
GE863 = myLib:GE836
GND VCC_ATMEL VCC_MDM = wirepad:3,81/1,4: THROUGH-HOLE PAD
IC1 = ftdichip:FT232R: Source: http://www.ftdichip.com/Documents/DataSheets/DS_FT232R_v104.pdf; MPN: FT232RQ; OC_FARNELL: 1146033; OC_NEWARK: 91K9919
ICSP1 = pinhead:PINHD-2X3: PIN HEADER
J1 = SparkFun:POWER_JACK: Power Jack This is the standard 5.5mm barrel jack for power. The PTH is the most common, proven, reliable, footprint. All others are experimental. The Slot footprint only works if the mill layer is transmitted to the PCB fab house so be warned. Spark Fun Electronics SKU : PRT-00119. Mating wall wart : TOL-00298 (and others)
JMDMSW MDMPWRJP4 R1-R22 R24-R28 = rcl:R-US_: RESISTOR, American symbol
JP5 MDMRX MDMTX = SparkFun:JUMPER-2: Jumper Basic 0.1" spaced jumper. Use with breakaway headers.
JPJTAG = pinhead:PINHD-2X5: PIN HEADER
JRST = resistor:R-US_: RESISTOR, American symbol
L1 = wuerth-elektronik:WE-CBF: SMD EMI Suppression Ferrite Beads - excellent anti-EMI properties - low DCR - impedances till 3000 ohms - rated current up to 6 A
OK3 OK4 = optocoupler:H11L*M: 6-Pin DIP Optocoupler Source: http://www.fairchildsemi.com/ds/H1/H11L2-M.pdf; OC_FARNELL: unknown; OC_NEWARK: unknown
POWER1 RESET = myLib:SWITCHPB_KPT-1187B
Q1 = crystal:CRYTAL: CRYSTAL
RP-SMA = myConnectors:RP-SMA_BOARD_EDGE: RP-SMA board edge male connector man part # 142-4701-801 or #132255RP
RX/TX_ATMEL RX/TX_TELIT = myHeaders:2.5_2HEADER
SD-CARD = SparkFun:SD_CARD_SOCKET: SD/MMC Socket Media socket for SD and MMC cards. Push-push type. Schematic element and footprint production proven. Spark Fun Electronics SKU : PRT-00136
SIM5036 = myLib:SIMCARD_5036
SW1 = myLib:SWITCHSLIDE_EG1390
T1 T2 = mytransistors:SOT-23_MMBT4403
TC7W125FU = myIC:SSOP8: ssop8 package
TELIT_ON/OFF TELIT_ON/OFF1 = myHeaders:2.5_1HEADER
U1 = myPowerRegulators:Q-LT1528: Q package for the LT1528 power Regulator, the heatsink connects to GND
UNMOUNTED = adafruit:EG1213: E-Switch right-angle slide SPDT Part #EG1213 http://www.ladyada.net/library/eagle
X1-X20 = con-tycoelectronics:RJ45: CORCOM Modular RJ Jacks No Shield Source: www.tycoelectronics.com .. ENG_DS_1654001_1099_RJ_L_0507.pdf
X24 = con-cypressindustries:MINI-USB-: MINI USB-B Conector Source: www.cypressindustries.com; OC_FARNELL: unknown; OC_NEWARK: unknown

## Net classes
0 default: width 0.152 mm, drill 0.381 mm, clearance 0.178 mm
1 power: width 0.254 mm, drill 0.381 mm, clearance 0.178 mm
2 gnd: width 0.254 mm, drill 0.381 mm, clearance 0.178 mm
3 VCC: width 0.254 mm, drill 0.381 mm, clearance 0.178 mm
4 aSignal: width 0.254 mm, drill 0.381 mm, clearance 0.178 mm